# EAGLE design multiOsh2 (EAGLE 8.4.3)
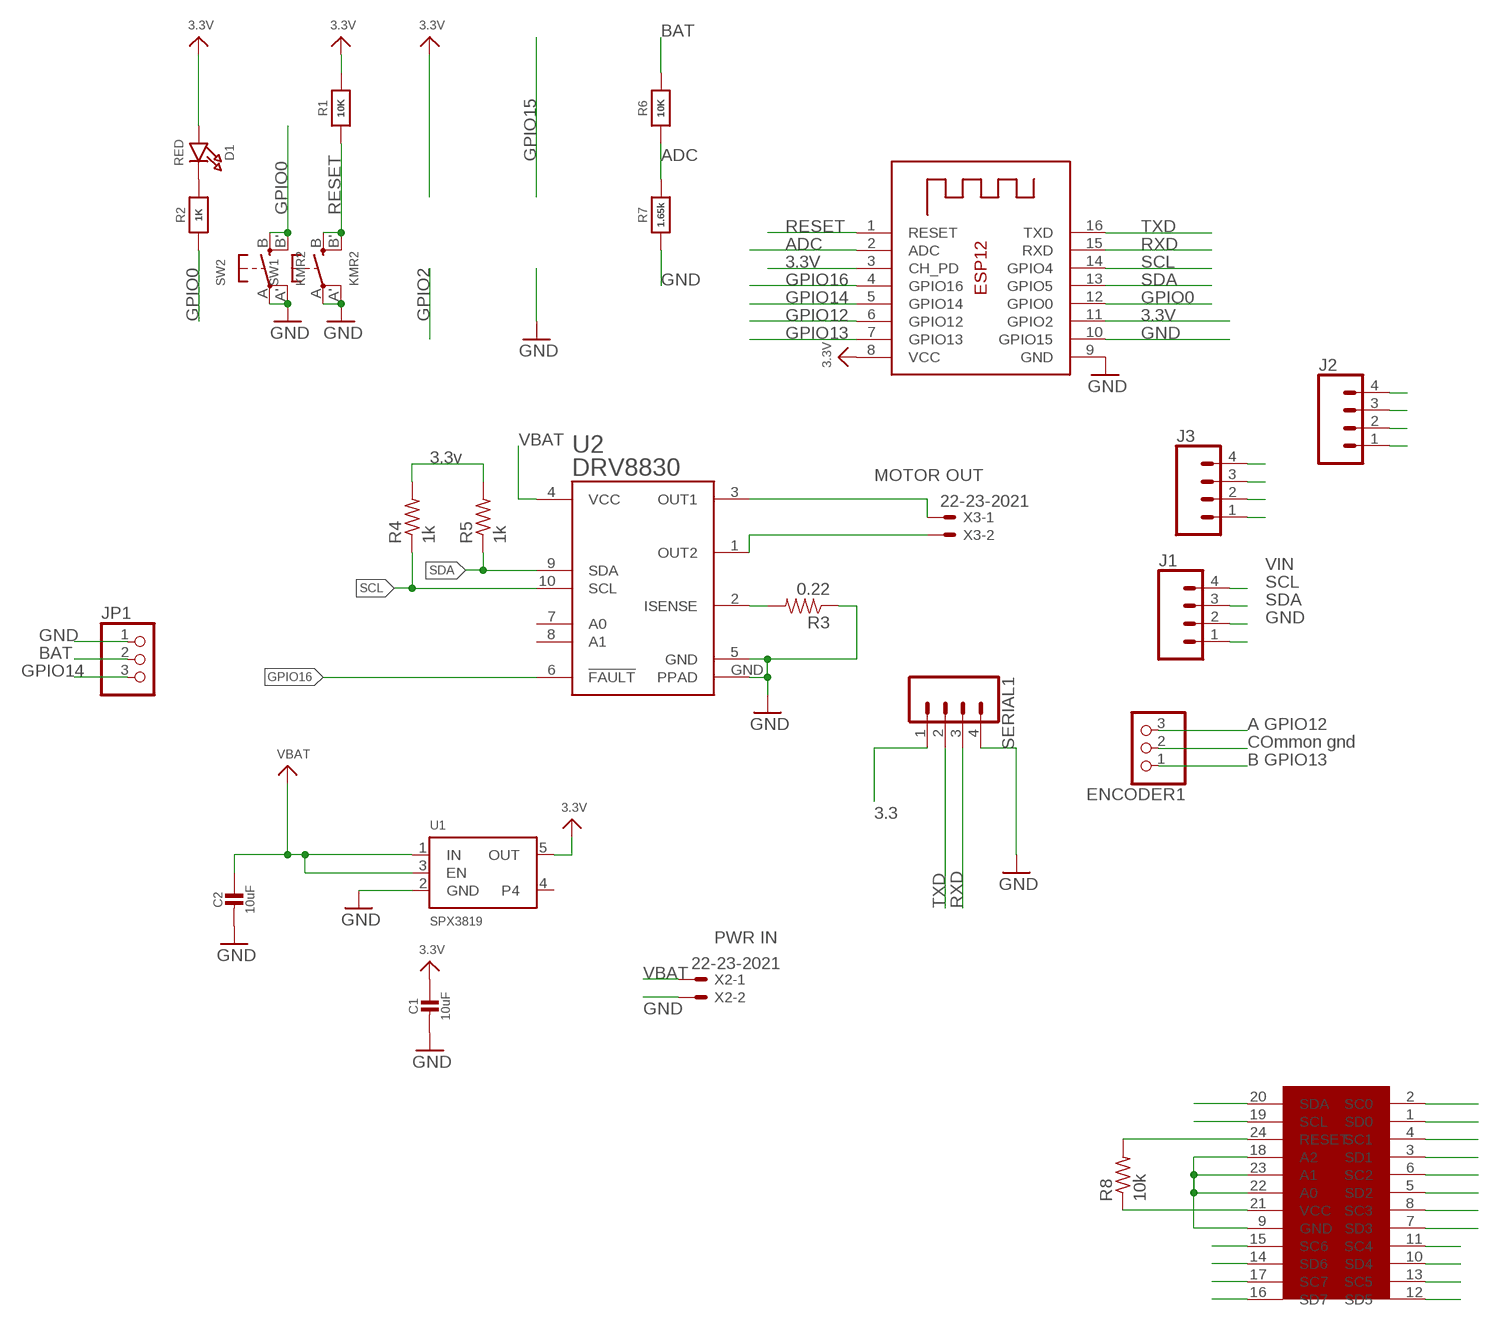
[diagram p0: schematic, sheet 1, part 1 of 3]
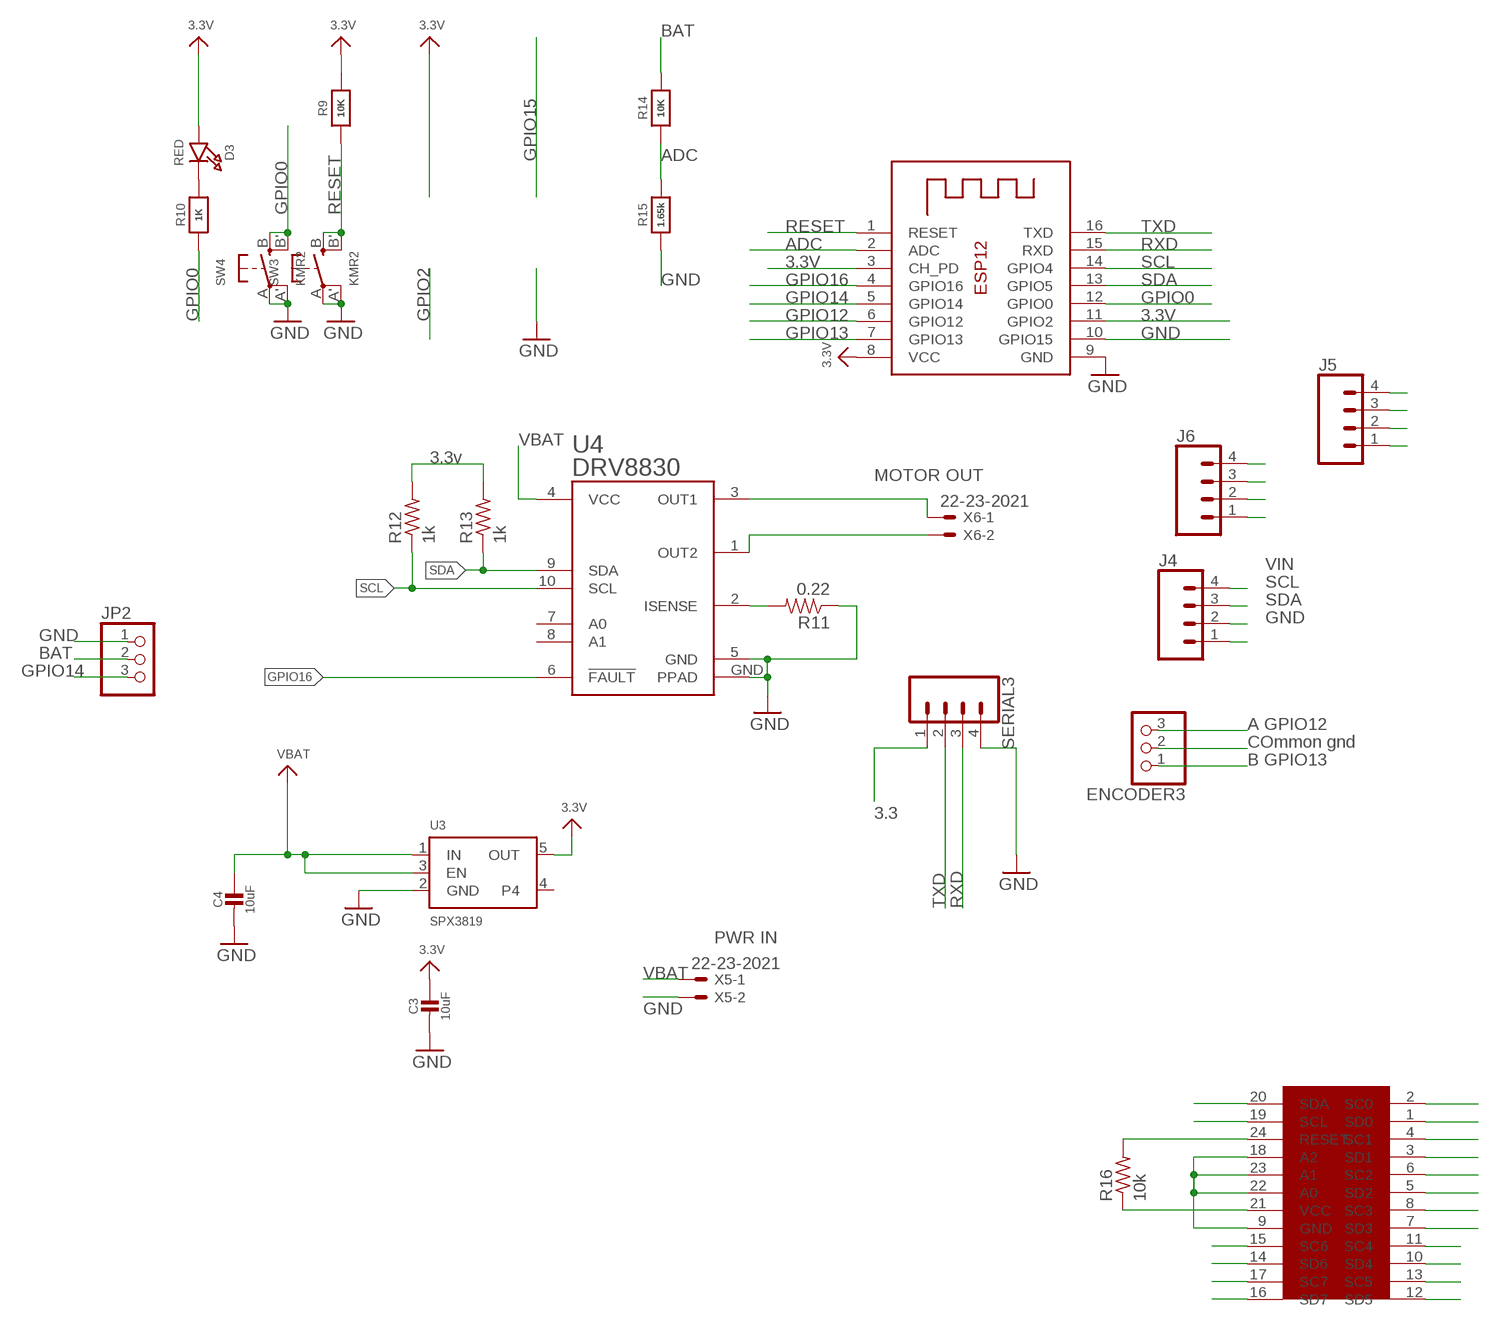
[diagram p1: schematic, sheet 1, part 2 of 3]
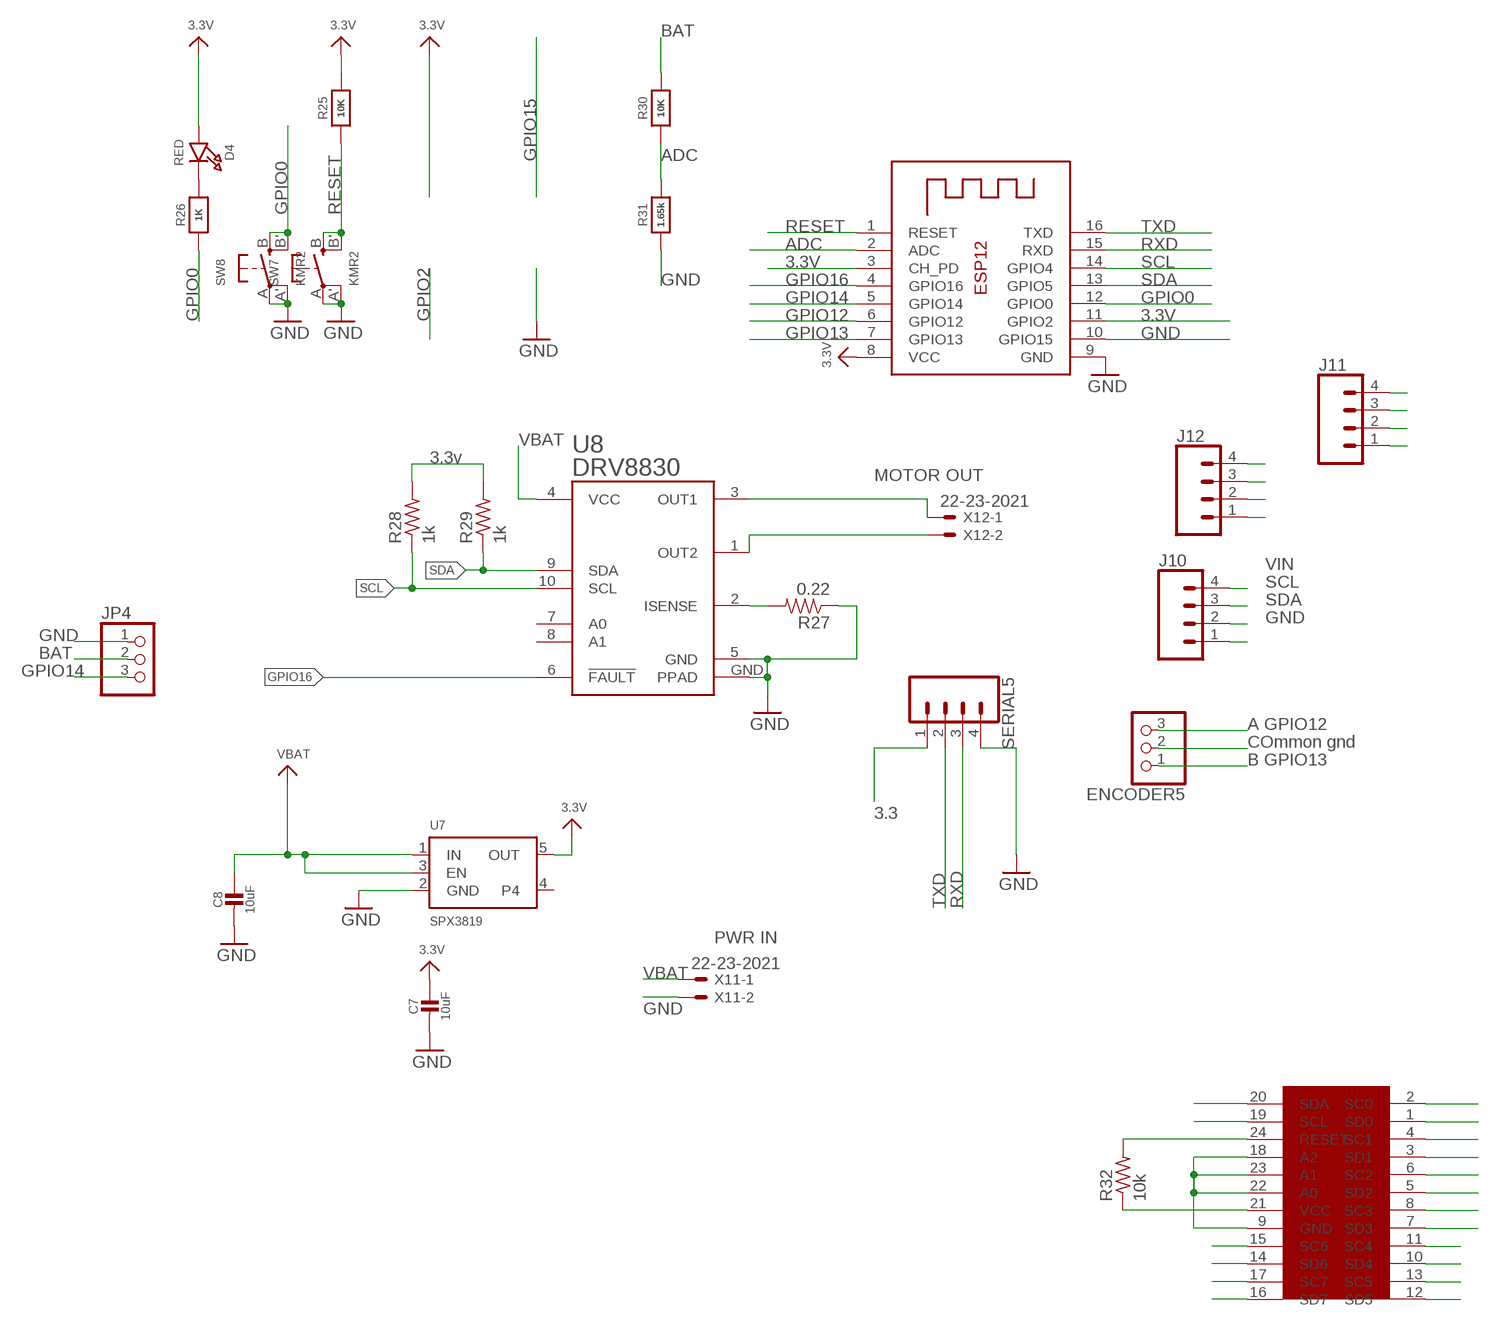
[diagram p2: schematic, sheet 1, part 3 of 3]

## Parts
C1  10uF  CAP_CERAMIC0805-NOOUTLINE  [0805-NO]
C2  10uF  CAP_CERAMIC0805-NOOUTLINE  [0805-NO]
C3  10uF  CAP_CERAMIC0805-NOOUTLINE  [0805-NO]
C4  10uF  CAP_CERAMIC0805-NOOUTLINE  [0805-NO]
C7  10uF  CAP_CERAMIC0805-NOOUTLINE  [0805-NO]
C8  10uF  CAP_CERAMIC0805-NOOUTLINE  [0805-NO]
D1  RED  LED0805_NOOUTLINE  [CHIPLED_0805_NOOUTLINE]
D3  RED  LED0805_NOOUTLINE  [CHIPLED_0805_NOOUTLINE]
D4  RED  LED0805_NOOUTLINE  [CHIPLED_0805_NOOUTLINE]
ENCODER1  PINHD-1X3  [1X03]
ENCODER3  PINHD-1X3  [1X03]
ENCODER5  PINHD-1X3  [1X03]
J1  CONN_04  [1X04]
J2  CONN_04  [1X04]
J3  CONN_04  [1X04]
J4  CONN_04  [1X04]
J5  CONN_04  [1X04]
J6  CONN_04  [1X04]
J10  CONN_04  [1X04]
J11  CONN_04  [1X04]
J12  CONN_04  [1X04]
JP1  PINHD-1X3  [1X03]
JP2  PINHD-1X3  [1X03]
JP4  PINHD-1X3  [1X03]
R1  10K  RESISTOR0805_NOOUTLINE  [0805-NO]
R2  1K  RESISTOR0805_NOOUTLINE  [0805-NO]
R3  0.22  0.22OHM1/4W1%(0805)  [0805]
R4  1k  R-US_R0805  [R0805]
R5  1k  R-US_R0805  [R0805]
R6  10K  RESISTOR0805_NOOUTLINE  [0805-NO]
R7  1.65k  RESISTOR0805_NOOUTLINE  [0805-NO]
R8  10k  R-US_M0805  [M0805]
R9  10K  RESISTOR0805_NOOUTLINE  [0805-NO]
R10  1K  RESISTOR0805_NOOUTLINE  [0805-NO]
R11  0.22  0.22OHM1/4W1%(0805)  [0805]
R12  1k  R-US_R0805  [R0805]
R13  1k  R-US_R0805  [R0805]
R14  10K  RESISTOR0805_NOOUTLINE  [0805-NO]
R15  1.65k  RESISTOR0805_NOOUTLINE  [0805-NO]
R16  10k  R-US_M0805  [M0805]
R25  10K  RESISTOR0805_NOOUTLINE  [0805-NO]
R26  1K  RESISTOR0805_NOOUTLINE  [0805-NO]
R27  0.22  0.22OHM1/4W1%(0805)  [0805]
R28  1k  R-US_R0805  [R0805]
R29  1k  R-US_R0805  [R0805]
R30  10K  RESISTOR0805_NOOUTLINE  [0805-NO]
R31  1.65k  RESISTOR0805_NOOUTLINE  [0805-NO]
R32  10k  R-US_M0805  [M0805]
SERIAL1  CONN_04  [1X04]
SERIAL3  CONN_04  [1X04]
SERIAL5  CONN_04  [1X04]
SW1  KMR2  SWITCH_TACT_SMT4.6X2.8  [BTN_KMR2_4.6X2.8]
SW2  KMR2  SWITCH_TACT_SMT4.6X2.8  [BTN_KMR2_4.6X2.8]
SW3  KMR2  SWITCH_TACT_SMT4.6X2.8  [BTN_KMR2_4.6X2.8]
SW4  KMR2  SWITCH_TACT_SMT4.6X2.8  [BTN_KMR2_4.6X2.8]
SW7  KMR2  SWITCH_TACT_SMT4.6X2.8  [BTN_KMR2_4.6X2.8]
SW8  KMR2  SWITCH_TACT_SMT4.6X2.8  [BTN_KMR2_4.6X2.8]
U1  SPX3819  VREG_SOT23-5  [SOT23-5]
U2  DRV8830  [MSOP-10-GNDPAD]
U3  SPX3819  VREG_SOT23-5  [SOT23-5]
U4  DRV8830  [MSOP-10-GNDPAD]
U7  SPX3819  VREG_SOT23-5  [SOT23-5]
U8  DRV8830  [MSOP-10-GNDPAD]
U$8  TCA9548A  [QFN24-4X4]
U$16  TCA9548A  [QFN24-4X4]
U$35  TCA9548A  [QFN24-4X4]
X1  ESP-12  [ESP-12]
X2  22-23-2021  [22-23-2021]
X3  22-23-2021  [22-23-2021]
X4  ESP-12  [ESP-12]
X5  22-23-2021  [22-23-2021]
X6  22-23-2021  [22-23-2021]
X10  ESP-12  [ESP-12]
X11  22-23-2021  [22-23-2021]
X12  22-23-2021  [22-23-2021]

## Nets
3.3V: C1.1 C3.1 C7.1 D1.A D3.A D4.A J1.4 J2.4 J3.4 J4.4 J5.4 J6.4 J10.4 J11.4 J12.4 R1.2 R4.2 R5.2 R8.1 R9.2 R12.2 R13.2 R16.1 R25.2 R28.2 R29.2 R32.1 SERIAL1.1 SERIAL3.1 SERIAL5.1 U1.5(OUT) U3.5(OUT) U7.5(OUT) U$8.21(VCC) U$16.21(VCC) U$35.21(VCC) X1.3(CH_PD) X1.8(VCC) X1.11(GPIO2) X4.3(CH_PD) X4.8(VCC) X4.11(GPIO2) X10.3(CH_PD) X10.8(VCC) X10.11(GPIO2)
ADC: R6.1 R7.2 R14.1 R15.2 R30.1 R31.2 X1.2(ADC) X4.2(ADC) X10.2(ADC)
GND: C1.2 C2.2 C3.2 C4.2 C7.2 C8.2 ENCODER1.2 ENCODER3.2 ENCODER5.2 J1.1 J2.1 J3.1 J4.1 J5.1 J6.1 J10.1 J11.1 J12.1 JP1.1 JP2.1 JP4.1 R3.1 R7.1 R11.1 R15.1 R27.1 R31.1 SERIAL1.4 SERIAL3.4 SERIAL5.4 SW1.A'(P1) SW1.A(P) SW2.A'(P1) SW2.A(P) SW3.A'(P1) SW3.A(P) SW4.A'(P1) SW4.A(P) SW7.A'(P1) SW7.A(P) SW8.A'(P1) SW8.A(P) U1.2(GND) U2.5(GND) U2.GND(PPAD) U3.2(GND) U4.5(GND) U4.GND(PPAD) U7.2(GND) U8.5(GND) U8.GND(PPAD) U$8.9(GND) U$8.18(A2) U$8.22(A0) U$8.23(A1) U$16.9(GND) U$16.18(A2) U$16.22(A0) U$16.23(A1) U$35.9(GND) U$35.18(A2) U$35.22(A0) U$35.23(A1) X1.9(GND) X1.10(GPIO15) X2.2 X4.9(GND) X4.10(GPIO15) X5.2 X10.9(GND) X10.10(GPIO15) X11.2
GPIO0: R2.1 R10.1 R26.1 SW2.B'(S1) SW2.B(S) SW4.B'(S1) SW4.B(S) SW8.B'(S1) SW8.B(S) X1.12(GPIO0) X4.12(GPIO0) X10.12(GPIO0)
GPIO12: ENCODER1.3 ENCODER3.3 ENCODER5.3 X1.6(GPIO12) X4.6(GPIO12) X10.6(GPIO12)
GPIO13: ENCODER1.1 ENCODER3.1 ENCODER5.1 X1.7(GPIO13) X4.7(GPIO13) X10.7(GPIO13)
GPIO14: JP1.3 JP2.3 JP4.3 X1.5(GPIO14) X4.5(GPIO14) X10.5(GPIO14)
GPIO16: U2.6(!FAULT) U4.6(!FAULT) U8.6(!FAULT) X1.4(GPIO16) X4.4(GPIO16) X10.4(GPIO16)
MOT1: U2.1(OUT2) X3.2
MOT2: U2.3(OUT1) X3.1
MOT3: U4.1(OUT2) X6.2
MOT4: U4.3(OUT1) X6.1
MOT7: U8.1(OUT2) X12.2
MOT8: U8.3(OUT1) X12.1
N$1: D1.C R2.2
N$2: R3.2 U2.2(ISENSE)
N$3: R8.2 U$8.24(RESET)
N$4: D3.C R10.2
N$5: R11.2 U4.2(ISENSE)
N$6: R16.2 U$16.24(RESET)
N$7: D4.C R26.2
N$13: R27.2 U8.2(ISENSE)
N$14: R32.2 U$35.24(RESET)
RESET: R1.1 R9.1 R25.1 SW1.B'(S1) SW1.B(S) SW3.B'(S1) SW3.B(S) SW7.B'(S1) SW7.B(S) X1.1(RESET) X4.1(RESET) X10.1(RESET)
RXD: SERIAL1.3 SERIAL3.3 SERIAL5.3 X1.15(RXD) X4.15(RXD) X10.15(RXD)
SC1: U$8.2(SC0)
SC2: U$8.4(SC1)
SC3: U$8.6(SC2)
SC4: J3.2 U$8.8(SC3)
SC5: J1.2 U$8.15(SC6)
SC6: U$8.17(SC7)
SC7: U$8.11(SC4)
SC8: J2.2 U$8.13(SC5)
SC9: U$16.2(SC0)
SC10: U$16.4(SC1)
SC11: U$16.6(SC2)
SC12: J6.2 U$16.8(SC3)
SC13: J4.2 U$16.15(SC6)
SC14: U$16.17(SC7)
SC15: U$16.11(SC4)
SC24: J5.2 U$16.13(SC5)
SC25: U$35.2(SC0)
SC26: U$35.4(SC1)
SC27: U$35.6(SC2)
SC28: J12.2 U$35.8(SC3)
SC29: J10.2 U$35.15(SC6)
SC30: U$35.17(SC7)
SC31: U$35.11(SC4)
SC40: J11.2 U$35.13(SC5)
SCL: R4.1 R12.1 R28.1 U2.10(SCL) U4.10(SCL) U8.10(SCL) U$8.19(SCL) U$16.19(SCL) U$35.19(SCL) X1.14(GPIO4) X4.14(GPIO4) X10.14(GPIO4)
SD1: U$8.1(SD0)
SD2: U$8.3(SD1)
SD3: U$8.5(SD2)
SD4: J3.3 U$8.7(SD3)
SD5: J1.3 U$8.14(SD6)
SD6: U$8.16(SD7)
SD7: U$8.10(SD4)
SD8: J2.3 U$8.12(SD5)
SD9: U$16.1(SD0)
SD10: U$16.3(SD1)
SD11: U$16.5(SD2)
SD12: J6.3 U$16.7(SD3)
SD13: J4.3 U$16.14(SD6)
SD14: U$16.16(SD7)
SD15: U$16.10(SD4)
SD24: J5.3 U$16.12(SD5)
SD25: U$35.1(SD0)
SD26: U$35.3(SD1)
SD27: U$35.5(SD2)
SD28: J12.3 U$35.7(SD3)
SD29: J10.3 U$35.14(SD6)
SD30: U$35.16(SD7)
SD31: U$35.10(SD4)
SD40: J11.3 U$35.12(SD5)
SDA: R5.1 R13.1 R29.1 U2.9(SDA) U4.9(SDA) U8.9(SDA) U$8.20(SDA) U$16.20(SDA) U$35.20(SDA) X1.13(GPIO5) X4.13(GPIO5) X10.13(GPIO5)
TXD: SERIAL1.2 SERIAL3.2 SERIAL5.2 X1.16(TXD) X4.16(TXD) X10.16(TXD)
VBAT: C2.1 C4.1 C8.1 JP1.2 JP2.2 JP4.2 R6.2 R14.2 R30.2 U1.1(IN) U1.3(EN) U2.4(VCC) U3.1(IN) U3.3(EN) U4.4(VCC) U7.1(IN) U7.3(EN) U8.4(VCC) X2.1 X5.1 X11.1
Unconnected: U1.4 U2.7(A0) U2.8(A1) U3.4 U4.7(A0) U4.8(A1) U7.4 U8.7(A0) U8.8(A1)

## Notes on the sheet
- BAT | BAT
- BAT
- ADC | ADC
- ADC
- GND | GND
- GND
- VBAT | VBAT
- 3.3v | 3.3v
- MOTOR OUT | MOTOR OUT
- VBAT
- 3.3v
- MOTOR OUT
- VIN | VIN
- SCL | SCL
- SDA | SDA
- GND | GND
- GND | VIN | GND
- BAT | SCL | BAT
- GPIO14 | SDA | GPIO14
- GND
- GND
- A GPIO12 | BAT | A GPIO12
- COmmon gnd | GPIO14 | COmmon gnd
- B GPIO13 | B GPIO13
- A GPIO12
- 3.3 | COmmon gnd | 3.3
- B GPIO13
- 3.3
- PWR IN | PWR IN
- VBAT | VBAT
- GND | PWR IN | GND
- VBAT
- GND

## Library data of the parts
C1-C4 C7 C8 = microbuilder:CAP_CERAMIC: Ceramic Capacitors For new designs, use the packages preceded by an '_' character since they are more reliable: The following footprints should be used on most boards: _0402 - Standard footprint for regular board layouts _0603 - Standard footprint for regular board layouts _0805 - Standard footprint for regular board layouts _1206 - Standard footprint for regular board layouts For extremely tight-pitch boards where space is at a premium, the following 'micro-pitch' footprints can be used (smaller pads, no silkscreen outline, etc.): _0402MP - Micro-pitch footprint for very dense/compact boards _0603MP - Micro-pitch footprint for very dense/compact boards _0805MP - Micro-pitch footprint for very dense/compact boards _1206MP - Micro-pitch footprint for very dense/compact boards
D1 D3 D4 = microbuilder:LED: LED 0603 - 0603 Surface Mount Package 2mA: Green LED - Low Power (3.9mcd, 2ma, 1.7Vf) - Digikey: 475-2709-2-ND Orange LED - Low Power (9.8mcd, 2ma, 1.8Vf) - Digikey: 475-1194-2-ND Red LED - Low Power (5mcd, 2ma, 1.8Vf) - Digikey: 475-1195-2-ND Yellow LED - Low Power (7mcd, 2ma, 1.8Vf) - Digikey: 475-1196-2-ND 5mA: Blue LED - Low Power (17mcd, 5ma, 2.9Vf) - Digikey: LNJ937W8CRACT-ND 0805 - 0805 Surface Mount Package 2mA: Red LED (8.8mcd, 2mA, 1.8Vf, Clear) - Low Power [Digikey: 475-2510-1-ND] Green LED (5mcd, 2mA, 1.8Vf, Clear) - Low Power [Digikey: 475-2730-1-ND] Yellow LED (11.3mcd, 2mA, 1.8Vf, Clear) - Low Power [Digikey: 475-2555-1-ND] 20mA: Red LED (104mcd, 20mA, Diffused) - LS R976 [Digikey: 475-1278-6-ND] Red LED (12mcd, 20mA, 2.0Vf, Clear) - APT2012EC [Digikey: 754-1128-1-ND] Green LED (15mcd, 20mA, 2.2Vf, Clear) - APT2012GC [Digikey: 754-1131-1-ND] Orange LED (160mcd, 20mA, 2.1Vf, Clear) - APT2012SECK [Digikey: 754-1130-1-ND] 1206 - 1206 Surface Mount Package Green LED (26mcd, 20mA, Diffused) - LG N971 [Digikey: 475-1407-6-ND] Red LED (15mcd, 20mA, Diffused) - LH N974 [Digikey: 475-1416-6-ND] Cree - Cree High-Power Surface Mount LEDs XPEBWT-L1-0000-00D50 - White 111lm 350mA 2.9Vf 6200K 110° XTEAWT-00-0000-00000LEE3 - White 114lm 350mA 2.85Vf 5000K 115° Everlight - Everlight 45-21 Series Surface Mount LEDs 45-21/QK2C-B2832AC2CB2/2T - Warm White 2000mcd 20mA 3.25Vf 3050K 120° 45-21/LK2C-B38452C4CB2/2T - Nuetral White 2000mcd 20mA 3.25Vf 4150K 120° 45-21/LK2C-B50634C6CB2/2T - Cold White 2200mcd 20mA 3.25Vf 5650K 120° PLCC2 Reverse Mount LS T77K-J1L2-1-0-2-R18-Z - Red 11.25mcd 2mA 1.8Vf 630nm 120° LO T77K-L1M2-24-Z - Orange 19.6mcd 2mA 1.8Vf 606nm 120° LY T77K-K2M1-26-Z - Yellow 15.7mcd 2mA 1.8Vf 587nm 120°
ENCODER1 ENCODER3 ENCODER5 JP1 JP2 JP4 = adafruit:PINHD-1X3: PIN HEADER
J1-J6 J10-J12 SERIAL1 SERIAL3 SERIAL5 = SparkFun-Connectors:CONN_04: Multi connection point. Often used as Generic Header-pin footprint for 0.1 inch spaced/style header connections On any of the 0.1 inch spaced packages, you can populate with these: Break Away Headers - Straight <https://www.sparkfun.com/products/116> (PRT-00116) Break Away Male Headers - Right Angle <https://www.sparkfun.com/products/553> (PRT-00553) Female Headers <https://www.sparkfun.com/products/115> (PRT-00115) Break Away Headers - Machine Pin <https://www.sparkfun.com/products/117> (PRT-00117) Break Away Female Headers - Swiss Machine Pin <https://www.sparkfun.com/products/743> (PRT-00743) For SCREWTERMINALS and SPRING TERMINALS visit here: Screw Terimnals on SparkFun.com <https://www.sparkfun.com/search/results?term=Screw+Terminals> (5mm/3.5mm/2.54mm spacing) This device is also useful as a general connection point to wire up your design to another part of your project. Our various solder wires solder well into these plated through hole pads. Hook-Up Wire - Assortment (Stranded, 22 AWG) <https://www.sparkfun.com/products/11375> (PRT-11375) Hook-Up Wire - Assortment (Solid Core, 22 AWG) <https://www.sparkfun.com/products/11367> (PRT-11367) View the entire wire category on our website here <https://www.sparkfun.com/categories/141> Special notes: Molex polarized connector foot print use with SKU : PRT-08231 with associated crimp pins and housings. 1MM SMD Version SKU: PRT-10208; PROD_ID: CONN-09696
R1 R2 R6 R7 R9 R10 R14 R15 R25 R26 R30 R31 = microbuilder:RESISTOR: Resistors For new designs, use the packages preceded by an '_' character since they are more reliable: The following footprints should be used on most boards: _0402 - Standard footprint for regular board layouts _0603 - Standard footprint for regular board layouts _0805 - Standard footprint for regular board layouts _1206 - Standard footprint for regular board layouts For extremely tight-pitch boards where space is at a premium, the following 'micro-pitch' footprints can be used (smaller pads, no silkscreen outline, etc.): _0402MP - Micro-pitch footprint for very dense/compact boards _0603MP - Micro-pitch footprint for very dense/compact boards _0805MP - Micro-pitch footprint for very dense/compact boards _1206MP - Micro-pitch footprint for very dense/compact boards
R3 R11 R27 = SparkFun-Resistors:0.22OHM1/4W1%(0805): RES-09883; PROD_ID: RES-09883
R4 R5 R8 R12 R13 R16 R28 R29 R32 = adafruit:R-US_: RESISTOR, American symbol
SW1-SW4 SW7 SW8 = microbuilder:SWITCH_TACT_SMT: SMT Tact Switches 6x6mm - Digikey: P12940SCT-ND KMR2 (4.6x2.8mm) - Digikey: 401-1426-1-ND EVQ-PQHB55 - Light Touch, 160GF (4.5x4.5mm) - Digikey: P8090SCT-ND KMT0 - KMT021 NGJ LHS (etc.) IP68/Waterproof - Digikey: CKN10289CT-ND
U1 U3 U7 = microbuilder:VREG_SOT23-5: SOT23-5 Fixed Voltage Regulators Part Current Out V Out V In V Dropout θJA (°C/W) TJ (°C) Digikey Part No. ADP121 150mA 3.3V 3.4-5.5V 0.09V @ 150mA -- -- ADP121-AUJZ33R7CT-ND ADP121 150mA 3.0V 3.1-5.5V 0.09V @ 150mA -- -- ADP121-AUJZ30R7CT-ND ADP122 300mA 3.3V 3.4-5.5V 0.085V @ 300mA -- -- ADP122AUJZ-3.3-R7CT-ND ADP1712 300mA 3.3V 3.5-5.5V 0.17V @ 300mA -- -- ADP1712AUJZ-3.3-R7TR-ND AP7311 (Low Cost) 150mA 3.3V 3.5-6V 0.15V @ 150mA -- -- AP7311-33WG-7DICT-ND LD39015M18R 150mA 1.8V 1.9V-5.5V 0.08V @ 100mA -- -- 497-6977-1-ND LP2985A-33DBVR 150mA 3.3V 3.3-16V 0.28V @ 150mA 206 150 296-18479-1-ND MCP1824T-3302E/OT 300mA 3.3V 3.5V-6V 0.2V @ 300mA -- -- MCP1824T-3302E/OTCT-ND MIC5205-2.5YM5 TR 150mA 2.5V 2.7-16V 0.165V @ 150mA -- -- 576-1257-2-ND MIC5205-3.0YM5 TR 150mA 3.0V 3.2V-16V 0.165V @ 150mA -- -- 576-1258-2-ND MIC5205-3.3YM5 TR 150mA 3.3V 3.5V-16V 0.165V @ 150mA -- -- 576-1259-2-ND TPS780330220 150mA 3.3V+2.2V 3.6-5.5V 250mV Max -- -- 296-23332-1-ND TDA3663/N1,135 100mA 3.3V 3.5-45V 0.18V @ 50mA -- -- 568-5343-1-ND Max operating temp can be calculated using θJA, TJ (max junction temperature), and power in watts. Set the "Maximum Ambient Temperature" until it reaches TJ ("Max Junction Temperature"), which is the absolute limit for safe use of the regulator: Heat Sink Temperature Calculator <http://www.daycounter.com/Calculators/Heat-Sink-Temperature-Calculator.phtml> For example, With 12V source into a 3.3V LP2985 and a 30mA load, we are dissipating (12V-3.3V) * 0.03A = 0.261W. With a θJA of 206 °C/W, a TJ of 150°C, and 261mW we can safely use the chip without a heat sink up to 75°C (=147.1°C Junction Temperature).
U2 U4 U8 = SparkFun-PowerIC:DRV8830: DRV8830 I2C DC Motor Driver TSSOP-10 with exposed power pad 1A current limit, 2.75V to 6.8V
U$8 U$16 U$35 = si70xx-10:TCA9548A
X1 X4 X10 = microbuilder:ESP-12
X2 X3 X5 X6 X11 X12 = con-molex:22-23-2021: .100" (2.54mm) Center Header - 2 Pin; MF: MOLEX; MPN: 22-23-2021; OC_FARNELL: 1462926; OC_NEWARK: 25C3832

## Board
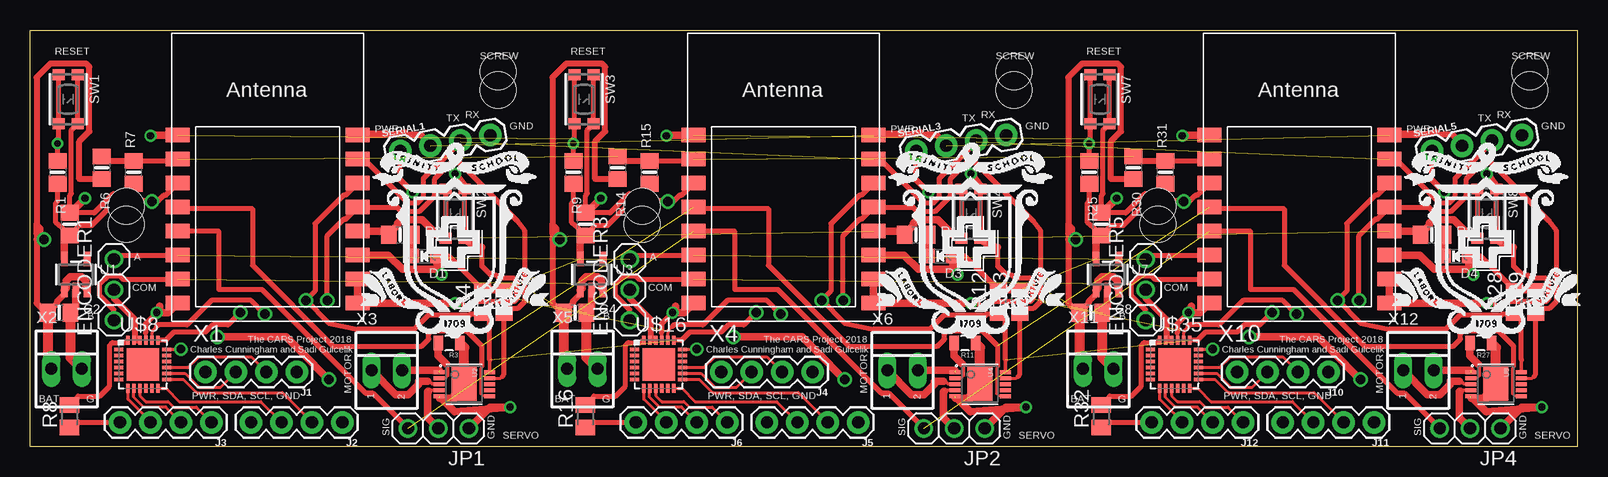
[diagram p3: board, top side]
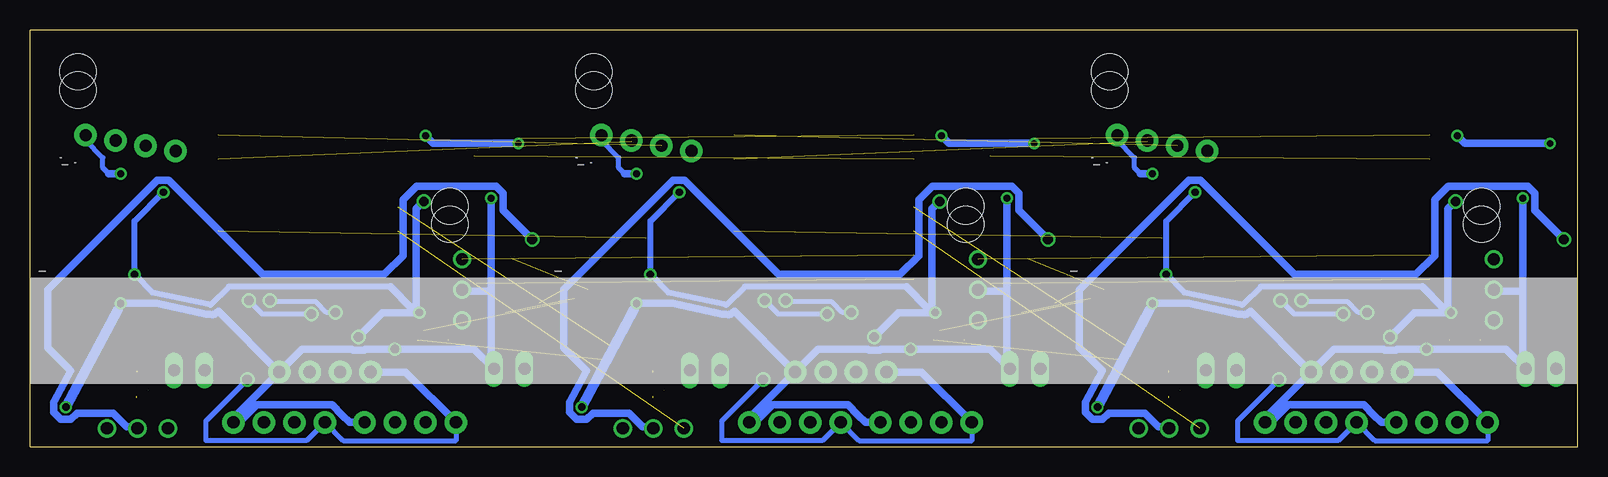
[diagram p4: board, bottom side, seen from below]

Size 129 x 34.72 mm. Coordinates in mm from the lower left corner, seen from the top.
Outline: 0,0 0,34.72 129,34.72 129,0 0,0
Copper layers (1*16): Top 0.035mm / dielectric 1.5mm / Bottom 0.035mm
Design rules "default": minimum track width 6mil, minimum drill 0.35mm, track to track 6mil, track to pad 6mil, pad to pad 6mil, via to via 6mil, smd to smd 6mil, copper to edge 40mil, drill to drill 6mil, minimum pad ring 10mil, minimum via ring 8mil, stop-mask expansion 4mil, vias tented up to drill 0mil, thermal gap 10mil
Holes 3 mm at 39,-9.21 8,-20.41 39,31.25 8,20.05 82,31.25 51,20.05 125,31.25 94,20.05 39,-10.74 8,-21.94 39,29.72 8,18.52 82,29.72 51,18.52 125,29.72 94,18.52

### Footprints (pad centres in the part's own frame; a part is rotated, then mirrored left to right if it is on the bottom)
0805-NO = smd 1.3 x 1.5: 1 -0.95,0; 2 0.95,0
CHIPLED_0805_NOOUTLINE = smd 1.2 x 1.2: A 0,-1.05; C 0,1.05
1X03 = drill 1.016: 1 -2.54,0; 2 0,0; 3 2.54,0
1X04 = drill 1.016 pad 1.88: 1 0,0; 2 2.54,0; 3 5.08,0; 4 7.62,0
0805 = smd 0.8 x 1.2: 1 -0.9,0; 2 0.9,0
R0805 = smd 1.1 x 1.4: 1 -1,0; 2 1,0
M0805 = smd 1.3 x 1.6: 1 -0.95,0; 2 0.95,0
BTN_KMR2_4.6X2.8 = smd 0.9 x 1: A 2.05,0.8; A' -2.05,0.8; B 2.05,-0.8; B' -2.05,-0.8
SOT23-5 = smd 0.55 x 1.2: 1 -0.95,-1.3; 2 0,-1.3; 3 0.95,-1.3; 4 0.95,1.3; 5 -0.95,1.3
MSOP-10-GNDPAD = smd 0.305 x 0.889: 1 -1,-2.11; 2 -0.5,-2.11; 3 0,-2.11; 4 0.5,-2.11; 5 1,-2.11; 6 1,2.11; 7 0.5,2.11; 8 0,2.11; 9 -0.5,2.11; 10 -1,2.11 | smd 2.794 x 2.083: GND 0,0
QFN24-4X4 = smd 0.75 x 0.3: 1 -2,1.25; 2 -2,0.75; 3 -2,0.25; 4 -2,-0.25; 5 -2,-0.75; 6 -2,-1.25; 13 2,-1.25; 14 2,-0.75; 15 2,-0.25; 16 2,0.25; 17 2,0.75; 18 2,1.25 | smd 0.3 x 0.75: 7 -1.25,-2; 8 -0.75,-2; 9 -0.25,-2; 10 0.25,-2; 11 0.75,-2; 12 1.25,-2; 19 1.25,2; 20 0.75,2; 21 0.25,2; 22 -0.25,2; 23 -0.75,2; 24 -1.25,2 | smd 2.7 x 2.7: EXP 0,0
ESP-12 = smd 2 x 1.2: 1 -7.5,4.5; 2 -7.5,2.5; 3 -7.5,0.5; 4 -7.5,-1.5; 5 -7.5,-3.5; 6 -7.5,-5.5; 7 -7.5,-7.5; 8 -7.5,-9.5; 9 7.5,-9.5; 10 7.5,-7.5; 11 7.5,-5.5; 12 7.5,-3.5; 13 7.5,-1.5; 14 7.5,0.5; 15 7.5,2.5; 16 7.5,4.5
22-23-2021 = drill 1 long: 1 -1.27,0; 2 1.27,0

### Placement (x,y rotation side)
C1  3.3,18.54 90 top
C2  2.41,11.18 0 top
C3  46.3,18.54 90 top
C4  45.41,11.18 0 top
C7  89.3,18.54 90 top
C8  88.41,11.18 0 top
D1  32.89,15.88 90 top
D3  75.89,15.88 90 top
D4  118.89,15.88 90 top
ENCODER1  6.99,13.08 90 top
ENCODER3  49.98,13.08 90 top
ENCODER5  92.98,13.08 90 top
J1  22.23,6.22 180 top
J2  26.04,2.03 180 top
J3  15.11,2.03 180 top
J4  65.22,6.22 180 top
J5  69.03,2.03 180 top
J6  58.11,2.03 180 top
J10  108.22,6.22 180 top
J11  112.03,2.03 180 top
J12  101.11,2.03 180 top
JP1  34.04,1.52 180 top
JP2  77.04,1.52 180 top
JP4  120.04,1.52 180 top
R1  2.29,22.86 270 top
R2  30.86,17.65 0 top
R3  34.92,8.64 180 top
R4  37.72,12.07 90 top
R5  39.5,12.07 90 top
R6  5.97,23.24 270 top
R7  8.64,22.86 90 top
R8  3.28,2.54 90 top
R9  45.29,22.86 270 top
R10  73.86,17.65 0 top
R11  77.92,8.64 180 top
R12  80.72,12.07 90 top
R13  82.5,12.07 90 top
R14  48.97,23.24 270 top
R15  51.64,22.86 90 top
R16  46.28,2.54 90 top
R25  88.29,22.86 270 top
R26  116.86,17.65 0 top
R27  120.92,8.64 180 top
R28  123.72,12.07 90 top
R29  125.5,12.07 90 top
R30  91.97,23.24 270 top
R31  94.64,22.86 90 top
R32  89.28,2.54 90 top
SERIAL1  30.86,24.64 10 top
SERIAL3  73.86,24.64 10 top
SERIAL5  116.86,24.64 10 top
SW1  3.17,28.96 270 top
SW2  35.43,19.43 270 top
SW3  46.17,28.96 270 top
SW4  78.43,19.43 270 top
SW7  89.17,28.96 270 top
SW8  121.43,19.43 270 top
U1  3.81,14.35 0 top
U2  36.2,5.21 270 top
U3  46.81,14.35 0 top
U4  79.19,5.21 270 top
U7  89.81,14.35 0 top
U8  122.19,5.21 270 top
U$8  9.4,6.86 0 top
U$16  52.4,6.86 0 top
U$35  95.4,6.86 0 top
U$36  [HUZZAHLOGO]  21.59,32.13 0 bottom
U$37  [ADAFRUIT_TEXT_20MM]  22.61,6.22 0 bottom
U$38  TRIN  [TRIN]  35.3,16.97 0 top
U$39  [HUZZAHLOGO]  64.59,32.13 0 bottom
U$40  [ADAFRUIT_TEXT_20MM]  65.61,6.22 0 bottom
U$41  TRIN  [TRIN]  78.3,16.97 0 top
U$42  [HUZZAHLOGO]  107.59,32.13 0 bottom
U$43  [ADAFRUIT_TEXT_20MM]  108.61,6.22 0 bottom
U$44  TRIN  [TRIN]  121.3,16.97 0 top
X1  19.81,21.46 0 top
X2  3.05,6.48 0 top
X3  29.72,6.35 0 top
X4  62.81,21.46 0 top
X5  46.05,6.48 0 top
X6  72.72,6.35 0 top
X10  105.81,21.46 0 top
X11  89.05,6.48 0 top
X12  115.72,6.35 0 top

### Tracks (layer width: path | path; a pad name or v marks a point on that pad's centre or on a via)
3.3V  (via drill 0.6, 0.8)  (2 unrouted)
  Top 0.254: 9.62,9.49 9.65,9.46 U$8.21 | 52.62,9.49 52.65,9.46 U$16.21 | 95.61,9.49 95.65,9.46 U$35.21
  Top 0.406: 12.19,22.09 X1.3 11.32,20.97 11.14,20.97 10.65,20.48 10.41,20.48 | R1.2 2.29,20.45 2.15,20.31 2.15,18.67 2.38,18.44 2.46,18.44 C1.1 4.15,18.44 5.14,18.44 7.19,20.48 10.41,20.48 | 33.94,15.34 D1.A 34.91,15.88 R4.2 | 30.86,22.23 SERIAL1.1 | v10.16,20.45 10.38,20.45 10.41,20.48 | 12.1,12.18 X1.8 | v10.54,11.18 9.62,10.25 9.62,9.49 | R8.1 3.72,2.03 J3.4 | 55.19,22.09 X4.3 54.32,20.97 54.14,20.97 53.66,20.48 53.41,20.48 | R9.2 45.29,20.45 45.15,20.31 45.15,18.67 45.38,18.44 45.46,18.44 C3.1 47.15,18.44 48.14,18.44 50.19,20.48 53.41,20.48 | 76.94,15.34 D3.A 77.91,15.88 R12.2 | 73.86,22.23 SERIAL3.1 | v53.16,20.45 53.38,20.45 53.41,20.48 | 55.1,12.18 X4.8 | v53.54,11.18 52.62,10.25 52.62,9.49 | R16.1 46.72,2.03 J6.4 | 98.19,22.09 X10.3 97.32,20.97 97.14,20.97 96.66,20.48 96.41,20.48 | R25.2 88.29,20.45 88.15,20.31 88.15,18.67 88.38,18.44 88.46,18.44 C7.1 90.15,18.44 91.14,18.44 93.19,20.48 96.41,20.48 | 119.94,15.34 D4.A 120.91,15.88 R28.2 | 116.86,22.23 SERIAL5.1 | v96.16,20.45 96.38,20.45 96.41,20.48 | 98.1,12.18 X10.8 | v96.54,11.18 95.61,10.25 95.61,9.49 | R32.1 89.72,2.03 J12.4
  Top 0.508: 10.79,11.68 10.54,11.43 v10.54,11.18 | v31.88,21.21 30.86,22.23 | 53.8,11.68 53.54,11.43 v53.54,11.18 | v74.88,21.21 73.86,22.23 | 96.8,11.68 96.54,11.43 v96.54,11.18 | v117.88,21.21 116.86,22.23
  Top 0.61: R4.2 R5.2 | U1.5 2.86,17.15 C1.1 | X1.8 11.53,11.18 v10.54,11.18 | 10.79,11.68 10.79,11.3 | v24.89,5.59 23.67,6.81 23.67,6.82 21.35,9.14 v15.62,9.14 | X1.11 29.84,15.96 31.03,14.77 33.87,14.77 | 33.87,14.77 v34.29,14.35 | D1.A 33.94,14.84 33.87,14.77 | R12.2 R13.2 | U3.5 45.86,17.15 C3.1 | X4.8 54.52,11.18 v53.54,11.18 | 53.8,11.68 53.8,11.3 | v67.89,5.59 66.67,6.81 66.67,6.82 64.35,9.14 v58.62,9.14 | X4.11 72.84,15.96 74.03,14.77 76.87,14.77 | 76.87,14.77 v77.29,14.35 | D3.A 76.94,14.84 76.87,14.77 | R28.2 R29.2 | U7.5 88.86,17.15 C7.1 | X10.8 97.53,11.18 v96.54,11.18 | 96.8,11.68 96.8,11.3 | v110.89,5.59 109.67,6.81 109.67,6.82 107.35,9.14 v101.62,9.14 | X10.11 115.84,15.96 117.03,14.77 119.87,14.77 | 119.87,14.77 v120.29,14.35 | D4.A 119.94,14.84 119.87,14.77
  Bottom 0.406: 10.79,12.19 10.79,11.43 v10.54,11.18 | J3.4 7.49,0.5 16.88,0.5 J2.4 19.95,0.5 28.32,0.5 28.32,2.16 v24.89,5.59 | 53.8,12.19 53.8,11.43 v53.54,11.18 | J6.4 50.49,0.5 59.88,0.5 J5.4 62.95,0.5 71.32,0.5 71.32,2.16 v67.89,5.59 | 96.8,12.19 96.8,11.43 v96.54,11.18 | J12.4 93.49,0.5 102.88,0.5 J11.4 105.95,0.5 114.32,0.5 114.32,2.16 v110.89,5.59
  Bottom 0.508: 11.18,11.56 10.79,11.18 v10.54,11.18 | v31.88,21.21 34.29,18.8 v34.29,14.35 32.77,12.84 27.94,11.81 26.42,13.34 12.95,13.34 | 54.18,11.56 53.8,11.18 v53.54,11.18 | v74.88,21.21 77.29,18.8 v77.29,14.35 75.78,12.84 70.94,11.81 69.42,13.34 55.95,13.34 | 97.18,11.56 96.8,11.18 v96.54,11.18 | v117.88,21.21 120.29,18.8 v120.29,14.35 118.78,12.84 113.94,11.81 112.42,13.34 98.95,13.34
  Bottom 0.61: 10.79,11.68 10.79,12.19 10.79,19.81 v10.16,20.45 | 11.18,11.56 12.95,13.34 | v15.62,9.14 13.59,11.18 v10.54,11.18 | J1.4 11.68,6.22 J3.4 | 53.8,11.68 53.8,12.19 53.8,19.81 v53.16,20.45 | 54.18,11.56 55.95,13.34 | v58.62,9.14 56.59,11.18 v53.54,11.18 | J4.4 54.68,6.22 J6.4 | 96.8,11.68 96.8,12.19 96.8,19.81 v96.16,20.45 | 97.18,11.56 98.95,13.34 | v101.62,9.14 99.59,11.18 v96.54,11.18 | J10.4 97.68,6.22 J12.4
ADC  (2 unrouted)
  Top 0.406: R7.2 12.16,23.81 X1.2 | R15.2 55.16,23.81 X4.2 | R31.2 98.16,23.81 X10.2
  Top 0.508: R6.1 6.35,23.81 R7.2 | R14.1 49.35,23.81 R15.2 | R30.1 92.35,23.81 R31.2
GND  (via drill 0.6, 0.7)  (5 unrouted)
  Top 0.254: U$8.23 8.89,8.86 | 8.89,8.86 U$8.22 | 8.89,8.86 8.63,9.12 | U$8.18 12.55,8.11 v12.57,8.13 | U$8.9 9.15,4.25 9.64,3.76 11.49,3.76 11.95,3.3 13.84,3.3 J3.1 | U$16.23 51.89,8.86 | 51.89,8.86 U$16.22 | 51.89,8.86 51.63,9.12 | U$16.18 55.55,8.11 v55.57,8.13 | U$16.9 52.15,4.25 52.64,3.76 54.49,3.76 54.95,3.3 56.84,3.3 J6.1 | U$35.23 94.89,8.86 | 94.89,8.86 U$35.22 | 94.89,8.86 94.63,9.12 | U$35.18 98.55,8.11 v98.57,8.13 | U$35.9 95.15,4.25 95.64,3.76 97.49,3.76 97.95,3.3 99.84,3.3 J12.1
  Top 0.406: R7.1 7.82,21.09 6.94,21.09 5.34,19.49 C1.2 3.3,20.95 3.44,21.09 3.44,26.37 SW1.A SW1.A' | SW2.A SW2.A' 36.16,21.48 | 37.64,16.61 37.64,15.06 38.43,14.28 38.86,14.28 39.12,14.02 40.37,14.02 40.6,13.78 40.6,12.35 40.37,12.11 36.94,12.11 36.39,11.56 36.01,11.94 v35.43,11.94 | R15.1 50.82,21.09 49.94,21.09 48.34,19.49 C3.2 46.3,20.95 46.44,21.09 46.44,26.37 SW3.A SW3.A' | SW4.A SW4.A' 79.16,21.48 | 80.64,16.61 80.64,15.06 81.43,14.28 81.86,14.28 82.12,14.02 83.36,14.02 83.6,13.78 83.6,12.35 83.36,12.11 79.94,12.11 79.39,11.56 79,11.94 v78.43,11.94 | R31.1 93.82,21.09 92.94,21.09 91.34,19.49 C7.2 89.3,20.95 89.44,21.09 89.44,26.37 SW7.A SW7.A' | SW8.A SW8.A' 122.16,21.48 | 123.64,16.61 123.64,15.06 124.43,14.28 124.86,14.28 125.12,14.02 126.36,14.02 126.6,13.78 126.6,12.35 126.36,12.11 122.94,12.11 122.39,11.56 122,11.94 v121.43,11.94
  Top 0.508: 34.09,4.1 35.09,4.1 U2.GND 35.69,4.7 35.69,4.32 | v35.43,11.94 35.31,11.81 | 8.89,8.86 8.76,8.99 8.76,10.59 6.99,12.36 ENCODER1.2 | 77.08,4.1 78.08,4.1 U4.GND 78.69,4.7 78.69,4.32 | v78.43,11.94 78.31,11.81 | 51.89,8.86 51.76,8.99 51.76,10.59 49.98,12.36 ENCODER3.2 | 120.08,4.1 121.08,4.1 U8.GND 121.69,4.7 121.69,4.32 | v121.43,11.94 121.31,11.81 | 94.89,8.86 94.75,8.99 94.75,10.59 92.98,12.36 ENCODER5.2
  Top 0.61: C2.2 3.81,11.62 U1.2 | C1.2 3.36,19.49 v4.57,20.7 | 34.25,4.05 35.37,2.92 v40.01,3.3 38.35,3.3 JP1.1 | 34.25,4.05 34.14,4.05 | 34.25,4.05 35.42,4.05 35.69,4.32 | 37.64,16.61 37.01,16.61 SW2.A | 36.16,21.48 36.16,21.75 v35.43,22.73 | X1.10 X1.9 27.34,11.94 v35.43,11.94 | C4.2 46.81,11.62 U3.2 | C3.2 46.36,19.49 v47.57,20.7 | 77.25,4.05 78.37,2.92 v83,3.3 81.35,3.3 JP2.1 | 77.25,4.05 77.14,4.05 | 77.25,4.05 78.42,4.05 78.69,4.32 | 80.64,16.61 80.01,16.61 SW4.A | 79.16,21.48 79.16,21.75 v78.43,22.73 | X4.10 X4.9 70.34,11.94 v78.43,11.94 | C8.2 89.81,11.62 U7.2 | C7.2 89.36,19.49 v90.57,20.7 | 120.25,4.05 121.37,2.92 v126,3.3 124.35,3.3 JP4.1 | 120.25,4.05 120.14,4.05 | 120.25,4.05 121.42,4.05 121.69,4.32 | 123.64,16.61 123.01,16.61 SW8.A | 122.16,21.48 122.16,21.75 v121.43,22.73 | X10.10 X10.9 113.34,11.94 v121.43,11.94
  Top 0.813: X2.2 3.36,7.43 C2.2 | U2.GND 36.2,8.27 R3.1 | X5.2 46.36,7.43 C4.2 | U4.GND 79.19,8.27 R11.1 | X11.2 89.36,7.43 C8.2 | U8.GND 122.19,8.27 R27.1
  Bottom 0.406: 36.43,22.73 36.93,23.23 36.93,24.09 38.37,25.53 SERIAL1.4 | 79.43,22.73 79.93,23.23 79.93,24.09 81.36,25.53 SERIAL3.4 | 122.43,22.73 122.93,23.23 122.93,24.09 124.36,25.53 SERIAL5.4
  Bottom 0.508: 35.69,11.43 35.43,11.68 v35.43,11.94 | 78.69,11.43 78.43,11.68 v78.43,11.94 | 121.69,11.43 121.43,11.68 v121.43,11.94
  Bottom 0.61: 4.57,12.95 v4.57,20.7 | 4.57,12.95 4.57,6.73 X2.2 5.97,8.13 v12.57,8.13 15.07,8.13 15.16,8.03 16.08,8.03 16.18,8.13 20.32,8.13 J1.1 | v35.43,22.73 36.43,22.73 | ENCODER1.2 6.86,12.95 4.57,12.95 | J1.1 26.04,2.41 J2.1 25.54,2.03 24.09,3.48 17.82,3.48 16.97,2.63 16.37,2.03 J3.1 | J1.1 27.28,11.28 27.62,11.05 27.71,11.05 27.79,11 28.02,11.05 28.26,11.05 32.45,11.94 v35.43,11.94 | 47.57,12.95 v47.57,20.7 | 47.57,12.95 47.57,6.73 X5.2 48.97,8.13 v55.57,8.13 58.07,8.13 58.16,8.03 59.08,8.03 59.18,8.13 63.32,8.13 J4.1 | v78.43,22.73 79.43,22.73 | ENCODER3.2 49.86,12.95 47.57,12.95 | J4.1 69.03,2.41 J5.1 68.54,2.03 67.09,3.48 60.81,3.48 59.97,2.63 59.37,2.03 J6.1 | J4.1 70.28,11.28 70.62,11.05 70.71,11.05 70.79,11 71.02,11.05 71.26,11.05 75.45,11.94 v78.43,11.94 | 90.57,12.95 v90.57,20.7 | 90.57,12.95 90.57,6.73 X11.2 91.97,8.13 v98.57,8.13 101.07,8.13 101.16,8.03 102.08,8.03 102.18,8.13 106.32,8.13 J10.1 | v121.43,22.73 122.43,22.73 | ENCODER5.2 92.86,12.95 90.57,12.95 | J10.1 112.03,2.41 J11.1 111.54,2.03 110.09,3.48 103.81,3.48 102.97,2.63 102.37,2.03 J12.1 | J10.1 113.28,11.28 113.62,11.05 113.71,11.05 113.79,11 114.02,11.05 114.26,11.05 118.45,11.94 v121.43,11.94
  Bottom 0.813: 35.69,11.43 v40.01,3.3 | 78.69,11.43 v83,3.3 | 121.69,11.43 v126,3.3
GPIO0  (2 unrouted)
  Top 0.406: SW2.B' SW2.B | SW4.B' SW4.B | SW8.B' SW8.B
  Top 0.61: X1.12 29.6,17.96 29.88,17.69 | 29.88,17.69 R2.1 | 29.88,17.69 30.65,18.46 30.65,18.61 30.95,18.91 32.67,18.91 34.2,17.38 SW2.B | X4.12 72.6,17.96 72.88,17.69 | 72.88,17.69 R10.1 | 72.88,17.69 73.65,18.46 73.65,18.61 73.95,18.91 75.67,18.91 77.2,17.38 SW4.B | X10.12 115.6,17.96 115.88,17.69 | 115.88,17.69 R26.1 | 115.88,17.69 116.65,18.46 116.65,18.61 116.95,18.91 118.67,18.91 120.2,17.38 SW8.B
GPIO12  (2 unrouted)
  Top 0.406: ENCODER1.3 7.33,15.96 X1.6 | ENCODER3.3 50.33,15.96 X4.6 | ENCODER5.3 93.33,15.96 X10.6
GPIO13  (2 unrouted)
  Top 0.406: ENCODER1.1 6.99,11.43 5.82,12.6 5.82,13.57 6.5,14.25 7.47,14.25 7.75,13.96 X1.7 | ENCODER3.1 49.98,11.43 48.82,12.6 48.82,13.57 49.5,14.25 50.47,14.25 50.76,13.96 X4.7 | ENCODER5.1 92.98,11.43 91.82,12.6 91.82,13.57 92.5,14.25 93.47,14.25 93.75,13.96 X10.7
GPIO14  (2 unrouted)
  Top 0.406: X1.5 15.69,17.96 15.75,17.91 15.75,13.08 19.32,13.08 27.97,4.44 28.58,4.44 JP1.3 | X4.5 58.69,17.96 58.75,17.91 58.75,13.08 62.32,13.08 70.97,4.44 71.58,4.44 JP2.3 | X10.5 101.69,17.96 101.75,17.91 101.75,13.08 105.32,13.08 113.97,4.44 114.58,4.44 JP4.3
GPIO16  (2 unrouted)
  Top 0.216: 37.64,6.72 37.64,6.58 37.55,6.49 37.55,4.43 37.73,4.24 38.27,4.24 U2.6 | 80.64,6.72 80.64,6.58 80.55,6.49 80.55,4.43 80.73,4.24 81.27,4.24 U4.6 | 123.64,6.72 123.64,6.58 123.55,6.49 123.55,4.43 123.73,4.24 124.27,4.24 U8.6
  Top 0.254: U2.6 38.32,4.22 | U4.6 81.32,4.22 | U8.6 124.32,4.22
  Top 0.406: X1.4 12.46,19.81 18.54,19.81 18.54,15.11 25.27,8.38 32.64,8.38 33.22,8.96 33.22,9.4 33.46,9.64 36.39,9.64 37.64,8.39 37.64,6.72 | X4.4 55.46,19.81 61.54,19.81 61.54,15.11 68.27,8.38 75.64,8.38 76.22,8.96 76.22,9.4 76.46,9.64 79.39,9.64 80.64,8.39 80.64,6.72 | X10.4 98.46,19.81 104.54,19.81 104.54,15.11 111.27,8.38 118.64,8.38 119.22,8.96 119.22,9.4 119.46,9.64 122.39,9.64 123.64,8.39 123.64,6.72
MOT1  (1 unrouted)
  Top 0.508: 34.09,6.37 34.09,6.32
  Top 0.61: 34.09,6.37 33.43,6.37 33.41,6.35 X3.2
MOT2
  Top 0.254: U2.3 34.07,5.22 33.5,5.22 33.27,5.46 33.13,5.46
  Top 0.61: X3.1 30.46,4.33 31.51,4.33 32.38,5.21 32.38,5.46 33.13,5.46
MOT3  (1 unrouted)
  Top 0.508: 77.08,6.37 77.08,6.32
  Top 0.61: 77.08,6.37 76.43,6.37 76.41,6.35 X6.2
MOT4
  Top 0.254: U4.3 77.07,5.22 76.5,5.22 76.27,5.46 76.13,5.46
  Top 0.61: X6.1 73.47,4.33 74.51,4.33 75.38,5.21 75.38,5.46 76.13,5.46
MOT7  (1 unrouted)
  Top 0.508: 120.08,6.37 120.08,6.32
  Top 0.61: 120.08,6.37 119.43,6.37 119.41,6.35 X12.2
MOT8
  Top 0.254: U8.3 120.07,5.22 119.5,5.22 119.27,5.46 119.13,5.46
  Top 0.61: X12.1 116.47,4.33 117.51,4.33 118.38,5.21 118.38,5.46 119.13,5.46
N$1
  Top 0.61: D1.C 31.84,17.62 R2.2
N$2
  Top 0.216: U2.2 34.12,5.74 34.66,5.74 34.84,5.93 34.84,6.76 34.72,6.89
  Top 0.61: R3.2 34.02,7.58 34.72,6.89
N$3  (1 unrouted)
  Top 0.406: R8.2 4,4.22 5.79,4.22 6.62,5.04 6.62,8.43 6.86,8.66 7.9,8.66 8.09,8.86
N$4
  Top 0.61: D3.C 74.84,17.62 R10.2
N$5
  Top 0.216: U4.2 77.12,5.74 77.66,5.74 77.84,5.93 77.84,6.76 77.72,6.89
  Top 0.61: R11.2 77.03,7.58 77.72,6.89
N$6  (1 unrouted)
  Top 0.406: R16.2 47,4.22 48.79,4.22 49.62,5.04 49.62,8.43 49.85,8.66 50.9,8.66 51.09,8.86
N$7
  Top 0.61: D4.C 117.84,17.62 R26.2
N$13
  Top 0.216: U8.2 120.12,5.74 120.66,5.74 120.84,5.93 120.84,6.76 120.72,6.89
  Top 0.61: R27.2 120.03,7.58 120.72,6.89
N$14  (1 unrouted)
  Top 0.406: R32.2 90,4.22 91.79,4.22 92.62,5.04 92.62,8.43 92.86,8.66 93.9,8.66 94.09,8.86
RESET  (via drill 0.55, 0.6)  (2 unrouted)
  Top 0.406: R1.1 v2.29,25.27 2.29,25.67 2.38,25.76 SW1.B SW1.B' | R9.1 v45.29,25.27 45.29,25.67 45.38,25.76 SW3.B SW3.B' | R25.1 v88.29,25.27 88.29,25.67 88.38,25.76 SW7.B SW7.B'
  Top 0.61: X1.1 10.09,25.96 v10.03,25.91 | X4.1 53.09,25.96 v53.03,25.91 | X10.1 96.09,25.96 v96.03,25.91
  Bottom 0.61: v2.29,25.27 9.4,25.27 v10.03,25.91 | v45.29,25.27 52.4,25.27 v53.03,25.91 | v88.29,25.27 95.4,25.27 v96.03,25.91
RXD  (2 unrouted)
  Top 0.406: 27.4,23.88 27.92,23.88 31.5,20.3 32.25,20.3 32.79,20.83 32.79,22.35 35.86,25.43 SERIAL1.3 | 70.4,23.88 70.92,23.88 74.5,20.3 75.25,20.3 75.79,20.83 75.79,22.35 78.86,25.43 SERIAL3.3 | 113.4,23.88 113.92,23.88 117.5,20.3 118.25,20.3 118.79,20.83 118.79,22.35 121.86,25.43 SERIAL5.3
  Top 0.61: 27.4,23.88 X1.15 | 70.4,23.88 X4.15 | 113.4,23.88 X10.15
SC4
  Top 0.254: J3.2 11.3,3.3 9.45,3.3 8.65,4.1 U$8.8
SC5
  Top 0.254: U$8.15 13.19,6.61 14.08,7.49 18.41,7.49 J1.2
SC8
  Top 0.254: U$8.13 12.78,5.61 13.89,4.5 21.03,4.5 J2.2
SC12
  Top 0.254: J6.2 54.3,3.3 52.45,3.3 51.65,4.1 U$16.8
SC13
  Top 0.254: U$16.15 56.19,6.61 57.08,7.49 61.41,7.49 J4.2
SC24
  Top 0.254: U$16.13 55.78,5.61 56.89,4.5 64.03,4.5 J5.2
SC28
  Top 0.254: J12.2 97.3,3.3 95.45,3.3 94.65,4.1 U$35.8
SC29
  Top 0.254: U$35.15 99.19,6.61 100.08,7.49 104.42,7.49 J10.2
SC40
  Top 0.254: U$35.13 98.78,5.61 99.89,4.5 107.03,4.5 J11.2
SCL  (via drill 0.8)  (5 unrouted)
  Top 0.305: U2.10 38.3,7.23 | U4.10 81.31,7.23 | U8.10 124.31,7.23
  Top 0.406: 38.3,7.23 38.3,10.58 37.79,11.09 | R4.1 36.76,11.07 36.64,10.95 33.18,10.95 32.02,9.79 27.31,9.79 24.89,10.31 23,12.19 v22.99,12.19 23.75,12.96 23.75,18.58 26.14,20.97 26.32,20.97 X1.14 | v17.53,11.18 16.5,10.15 15.2,10.15 14.59,9.55 11.99,9.55 11.3,8.86 10.7,8.86 | 81.31,7.23 81.31,10.58 80.79,11.09 | R12.1 79.76,11.07 79.64,10.95 76.18,10.95 75.02,9.79 70.31,9.79 67.89,10.31 66,12.19 v65.99,12.19 66.75,12.96 66.75,18.58 69.14,20.97 69.32,20.97 X4.14 | v60.53,11.18 59.5,10.15 58.2,10.15 57.59,9.55 54.99,9.55 54.3,8.86 53.7,8.86 | 124.31,7.23 124.31,10.58 123.79,11.09 | R28.1 122.76,11.07 122.64,10.95 119.18,10.95 118.02,9.79 113.31,9.79 110.89,10.31 109,12.19 v108.99,12.19 109.75,12.96 109.75,18.58 112.14,20.97 112.32,20.97 X10.14 | v103.53,11.18 102.5,10.15 101.2,10.15 100.59,9.55 97.99,9.55 97.3,8.86 96.7,8.86
  Top 0.508: R4.1 37.77,11.07 37.79,11.09 | R12.1 80.77,11.07 80.79,11.09 | R28.1 123.77,11.07 123.79,11.09
  Bottom 0.406: v17.53,11.18 18.26,11.18 19.14,12.06 22.85,12.06 v22.99,12.19 | v60.53,11.18 61.26,11.18 62.14,12.06 65.85,12.06 v65.99,12.19 | v103.53,11.18 104.26,11.18 105.14,12.06 108.85,12.06 v108.99,12.19
SD4
  Top 0.254: U$8.7 8.17,4.84 8.17,3.94 10.03,2.07 J3.3
SD5
  Top 0.254: U$8.14 12.92,6.11 14.08,4.95 15.88,4.95 J1.3
SD8
  Top 0.254: U$8.12 11.32,4.86 12.42,3.76 19.23,3.76 J2.3
SD12
  Top 0.254: U$16.7 51.17,4.84 51.17,3.94 53.03,2.07 J6.3
SD13
  Top 0.254: U$16.14 55.92,6.11 57.08,4.95 58.88,4.95 J4.3
SD24
  Top 0.254: U$16.12 54.32,4.86 55.42,3.76 62.23,3.76 J5.3
SD28
  Top 0.254: U$35.7 94.17,4.84 94.17,3.94 96.03,2.07 J12.3
SD29
  Top 0.254: U$35.14 98.92,6.11 100.08,4.95 101.88,4.95 J10.3
SD40
  Top 0.254: U$35.12 97.32,4.86 98.42,3.76 105.23,3.76 J11.3
SDA  (via drill 0.8)  (2 unrouted)
  Top 0.254: U2.9 39.23,5.71 39.37,5.84 | 10.54,10.03 10.17,9.67 10.17,9.49 10.15,9.46 U$8.20 | U4.9 82.23,5.71 82.37,5.84 | 53.54,10.03 53.17,9.67 53.17,9.49 53.15,9.46 U$16.20 | U8.9 125.23,5.71 125.37,5.84 | 96.54,10.03 96.17,9.67 96.17,9.49 96.15,9.46 U$35.20
  Top 0.406: 39.37,5.84 39.5,6.1 R5.1 39.93,11.5 40.62,11.5 41.21,12.09 41.21,18.03 40.6,18.85 35.81,23.64 35.06,23.64 33.73,22.31 33.73,20.86 32.49,19.62 30.94,19.62 30.6,19.96 X1.13 26.32,18.97 26.14,18.97 24.77,17.59 v24.77,12.19 | v19.56,11.05 18.41,12.19 15.11,12.19 13.08,10.16 10.67,10.16 10.54,10.03 | 82.37,5.84 82.5,6.1 R13.1 82.93,11.5 83.62,11.5 84.21,12.09 84.21,18.03 83.6,18.85 78.81,23.64 78.06,23.64 76.73,22.31 76.73,20.86 75.49,19.62 73.94,19.62 73.6,19.96 X4.13 69.32,18.97 69.14,18.97 67.77,17.59 v67.77,12.19 | v62.56,11.05 61.41,12.19 58.11,12.19 56.08,10.16 53.67,10.16 53.54,10.03 | 125.37,5.84 125.5,6.1 R29.1 125.93,11.5 126.62,11.5 127.21,12.09 127.21,18.03 126.6,18.85 121.81,23.64 121.06,23.64 119.73,22.31 119.73,20.86 118.49,19.62 116.94,19.62 116.6,19.96 X10.13 112.32,18.97 112.14,18.97 110.77,17.59 v110.77,12.19 | v105.56,11.05 104.42,12.19 101.11,12.19 99.08,10.16 96.67,10.16 96.54,10.03
  Bottom 0.406: v19.56,11.05 23.62,11.05 v24.77,12.19 | v62.56,11.05 66.62,11.05 v67.77,12.19 | v105.56,11.05 109.62,11.05 v110.77,12.19
TXD  (2 unrouted)
  Top 0.508: 29.59,26.04 30.05,26.04 31.19,26.24 31.48,26.04 32.53,26.04 SERIAL1.2 | 72.59,26.04 73.05,26.04 74.19,26.24 74.48,26.04 75.53,26.04 SERIAL3.2 | 115.59,26.04 116.05,26.04 117.19,26.24 117.48,26.04 118.53,26.04 SERIAL5.2
  Top 0.61: 29.59,26.04 27.38,26.04 X1.16 | 72.59,26.04 70.38,26.04 X4.16 | 115.59,26.04 113.38,26.04 X10.16
VBAT  (via drill 0.8)  (5 unrouted)
  Top 0.254: U2.4 33.16,4.71 33.15,4.7 | U4.4 76.16,4.71 76.15,4.7 | U8.4 119.16,4.71 119.15,4.7
  Top 0.406: 0.55,18.54 0.91,18.18 0.91,17.51 v1.14,17.27 0.64,17.78 0.55,17.78 | 43.55,18.54 43.91,18.18 43.91,17.51 v44.14,17.27 43.63,17.78 43.55,17.78 | 86.55,18.54 86.91,18.18 86.91,17.51 v87.14,17.27 86.64,17.78 86.55,17.78
  Top 0.508: C2.1 2.26,11.97 2.26,12.12 2.86,12.72 U1.1 | R6.2 4.1,22.29 4.1,25.44 4.93,26.27 4.93,31.64 4.66,31.91 1.69,31.91 1.42,31.64 0.55,30.77 0.55,18.54 0.55,17.78 0.55,11.97 1.46,11.05 | 33.2,4.63 33.16,4.67 33.16,4.7 33.2,4.7 | C4.1 45.26,11.97 45.26,12.12 45.86,12.72 U3.1 | R14.2 47.1,22.29 47.1,25.44 47.93,26.27 47.93,31.64 47.66,31.91 44.69,31.91 44.42,31.64 43.55,30.77 43.55,18.54 43.55,17.78 43.55,11.97 44.46,11.05 | 76.2,4.63 76.16,4.67 76.16,4.7 76.2,4.7 | C8.1 88.26,11.97 88.26,12.12 88.86,12.72 U7.1 | R30.2 90.1,22.29 90.1,25.44 90.93,26.27 90.93,31.64 90.66,31.91 87.69,31.91 87.42,31.64 86.55,30.77 86.55,18.54 86.55,17.78 86.55,11.97 87.46,11.05 | 119.2,4.63 119.16,4.67 119.16,4.7 119.2,4.7
  Top 0.61: U1.3 4.62,13.19 4.62,13.83 4.29,14.16 3.33,14.16 3,13.83 3,13.19 U1.1 | 33.2,4.63 33.13,4.57 33.13,2.43 JP1.2 | 0.6,17.27 v1.14,17.27 | U3.3 47.62,13.19 47.62,13.83 47.3,14.16 46.33,14.16 46,13.83 46,13.19 U3.1 | 76.2,4.63 76.13,4.57 76.13,2.43 JP2.2 | 43.6,17.27 v44.14,17.27 | U7.3 90.62,13.19 90.62,13.83 90.3,14.16 89.33,14.16 89,13.83 89,13.19 U7.1 | 119.2,4.63 119.13,4.57 119.13,2.43 JP4.2 | 86.6,17.27 v87.14,17.27
  Top 0.813: X2.1 1.46,6.79 1.46,11.05 C2.1 | X5.1 44.46,6.79 44.46,11.05 C4.1 | X11.1 87.46,6.79 87.46,11.05 C8.1
  Bottom 0.508: 1.85,6.48 X2.1 | 44.85,6.48 X5.1 | 87.85,6.48 X11.1
  Bottom 0.61: JP1.2 34.16,1.65 34.92,1.65 35.31,2.03 35.31,2.05 36.05,2.79 39.08,2.79 39.59,2.29 40.42,2.29 41.02,2.88 41.02,3.72 39.62,6.35 41.53,8.25 41.53,13.08 32.39,22.22 31.46,22.22 23.59,14.35 13.46,14.35 11.91,15.91 11.91,20.56 10.75,21.71 4.15,21.71 3.56,21.12 3.56,19.69 v1.14,17.27 | JP2.2 77.16,1.65 77.92,1.65 78.31,2.03 78.31,2.05 79.05,2.79 82.08,2.79 82.59,2.29 83.42,2.29 84.02,2.88 84.02,3.72 82.62,6.35 84.53,8.25 84.53,13.08 75.39,22.22 74.46,22.22 66.59,14.35 56.46,14.35 54.91,15.91 54.91,20.56 53.75,21.71 47.15,21.71 46.56,21.12 46.56,19.69 v44.14,17.27 | JP4.2 120.16,1.65 120.92,1.65 121.31,2.03 121.31,2.05 122.05,2.79 125.08,2.79 125.59,2.29 126.42,2.29 127.02,2.88 127.02,3.72 125.62,6.35 127.53,8.25 127.53,13.08 118.39,22.22 117.46,22.22 109.59,14.35 99.46,14.35 97.91,15.91 97.91,20.56 96.75,21.71 90.15,21.71 89.56,21.12 89.56,19.69 v87.14,17.27

### Text on the board
tPlace: RESET | SCREW | RESET | SCREW | RESET | SCREW | TX | RX | TX | RX | TX | RX | PWR | GND | PWR | GND | PWR | GND | A | A | A | COM | GND | COM | GND | COM | GND | B | B | B | The CARS Project 2018 / Charles Cunningham and Sadi Gulcelik | The CARS Project 2018 / Charles Cunningham and Sadi Gulcelik | The CARS Project 2018 / Charles Cunningham and Sadi Gulcelik | PWR, SDA, SCL, GND | MOTOR | 1 | 2 | PWR, SDA, SCL, GND | MOTOR | 1 | 2 | PWR, SDA, SCL, GND | MOTOR | 1 | 2 | BAT | G | BAT | G | BAT | G | SIG | SIG | SIG | GND | SERVO | GND | SERVO | GND | SERVO